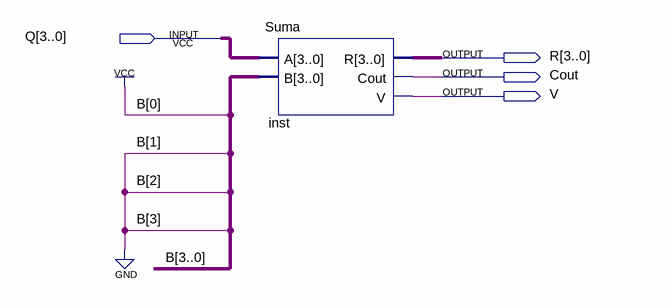
[diagram p0: schematic sheet]
// Quartus schematic INC.bdf as structural Verilog: 1 symbols, 4 pins
module INC (
  input  [3:0] Q,
  output [3:0] R,
  output Cout,
  output V
);

  Suma inst (.A(Q), .B(4'b0001), .R(R), .Cout(Cout), .V(V));
endmodule
